# Altium schematic sheet Amplifier Card.SchDoc
size A4
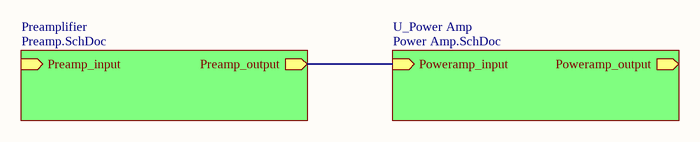
[diagram p0: Amplifier Card.SchDoc]

## Sub-sheets
Preamplifier = Preamp.SchDoc: Preamp_output (out), Preamp_input (in)
U_Power Amp = Power Amp.SchDoc: Poweramp_input (in), Poweramp_output (out)

## Nets
(unnamed): sheet Preamplifier/Preamp_output, sheet U_Power Amp/Poweramp_input